# EasyEDA Pro project 高频电路.eprj

# Schematic Schematic1
Create Date: 2024-05-19; Page Name: P1; Project Name: 高频电路; Schematic Name: Schematic1; Update Date: 2024-05-19; Company: 嘉立创EDA; Page Size: A4; Version: V1.0
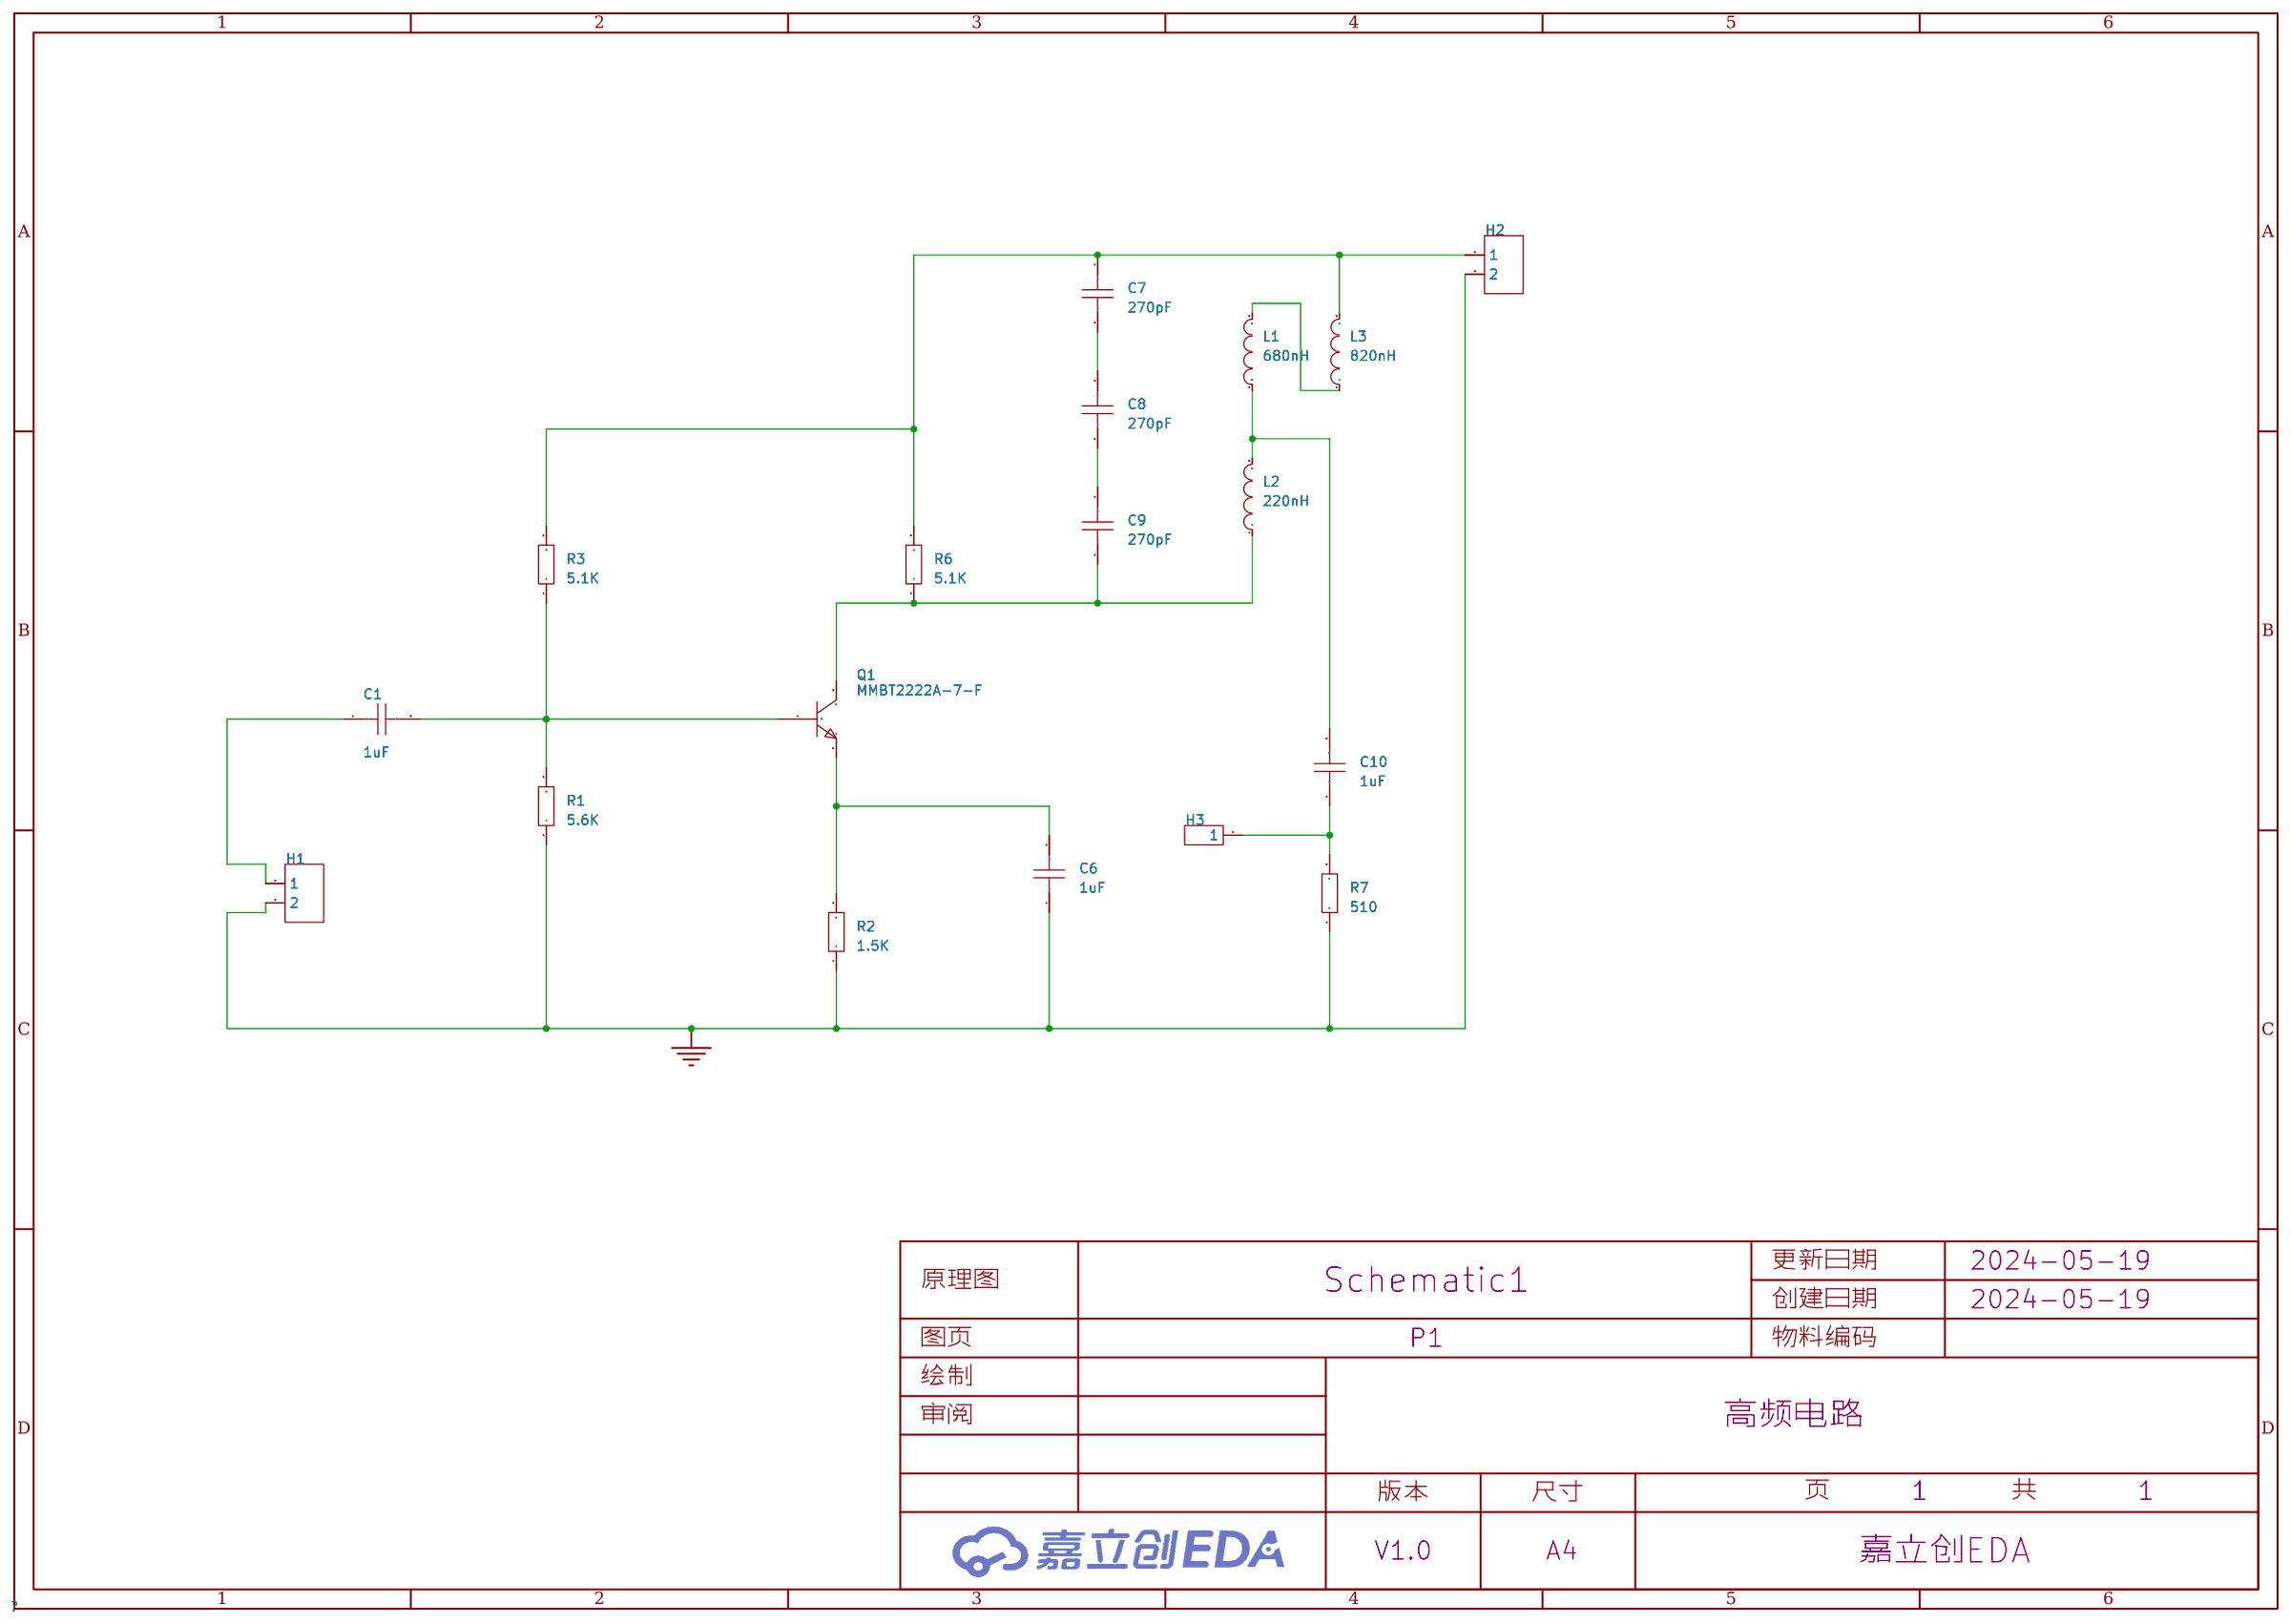
[diagram p0: schematic sheet]

## Parts
C1  1uF  [C0805]
C6  1uF  [C0805]
C7  270pF  [C0805]
C8  270pF  [C0805]
C9  270pF  [C0805]
C10  1uF  [C0805]
H1  -  [HDR-TH_2P-P2.54-V-F]
H2  -  [HDR-TH_2P-P2.54-V-F]
H3  -  [HDR-TH_1P-V-M_XKB_X4611WV-01I-C28D40]
L1  680nH  [L0805]
L2  220nH  [L0805]
L3  820nH  [L0805]
Q1  MMBT2222A-7-F  [SOT-23-3_L2.9-W1.6-P1.90-LS2.8-BR]
R1  5.6K  [R0805]
R2  1.5K  [R0805]
R3  5.1K  [R0805]
R6  5.1K  [R0805]
R7  510  [R0805]

## Library data of the parts
C1 C6-C10 = CAP_0805: Supplier Footprint: 0805
H1 H2 = HDR-F_2.54_1x2P: Supplier Part: C49661; Supplier Footprint: 插件
H3 = HDR-M_2.54_1x1P: Supplier Part: C81276; Supplier Footprint: 插件; JLCPCB Part Class: Extended Part
L1-L3 = L_0805
Q1 = MMBT2222A-7-F: 晶体管类型:NPN;集电极电流(Ic):600mA;集射极击穿电压(Vceo):40V;功率(Pd):310mW;直流电流增益(hFE@Ic,Vce):100@150mA,10V;; LCSC Part Name: 耐压:40V 电流:600mA NPN; Supplier Part: C94515; Manufacturer: DIODES(美台); Supplier Footprint: SOT-23; JLCPCB Part Class: 扩展库; Datasheet: https://atta.szlcsc.com/upload/public/pdf/source/20180307/C94515_15204091498191407767.pdf; Supplier: LCSC; Transistor Type: NPN; Collector Current (Ic): 600mA; Collector-Emitter Breakdown Voltage (Vceo): 40V; Power Dissipation (Pd): 310mW; DC Current Gain (hFE@Ic,Vce): 100@150mA,10V; Transition Frequency (fT): 300MHz; Collector Cut-Off Current (Icbo): 10nA; Collector-Emitter Saturation Voltage (VCE(sat)@Ic,Ib): 1V@500mA,50mA; Operating Temperature: -55℃~+150℃@(Tj)
R1-R3 R6 R7 = Res_0805: Supplier Footprint: 0805

## Nets
GND: C6.1 H1.2 H2.2 R1.1 R2.1 R7.1
Net-(C1-1): C1.1 H1.1
Net-(C1-2): C1.2 Q1.1(B) R1.2 R3.1
Net-(C6-2): C6.2 Q1.2(E) R2.2
Net-(C7-1): C7.1 H2.1 L3.2 R3.2 R6.2
Net-(C7-2): C7.2 C8.2
Net-(C8-1): C8.1 C9.2
Net-(C9-1): C9.1 L2.1 Q1.3(C) R6.1
Net-(C10-1): C10.1 H3.1 R7.2
Net-(C10-2): C10.2 L1.1 L2.2
Net-(L1-2): L1.2 L3.1

# Board PCB1
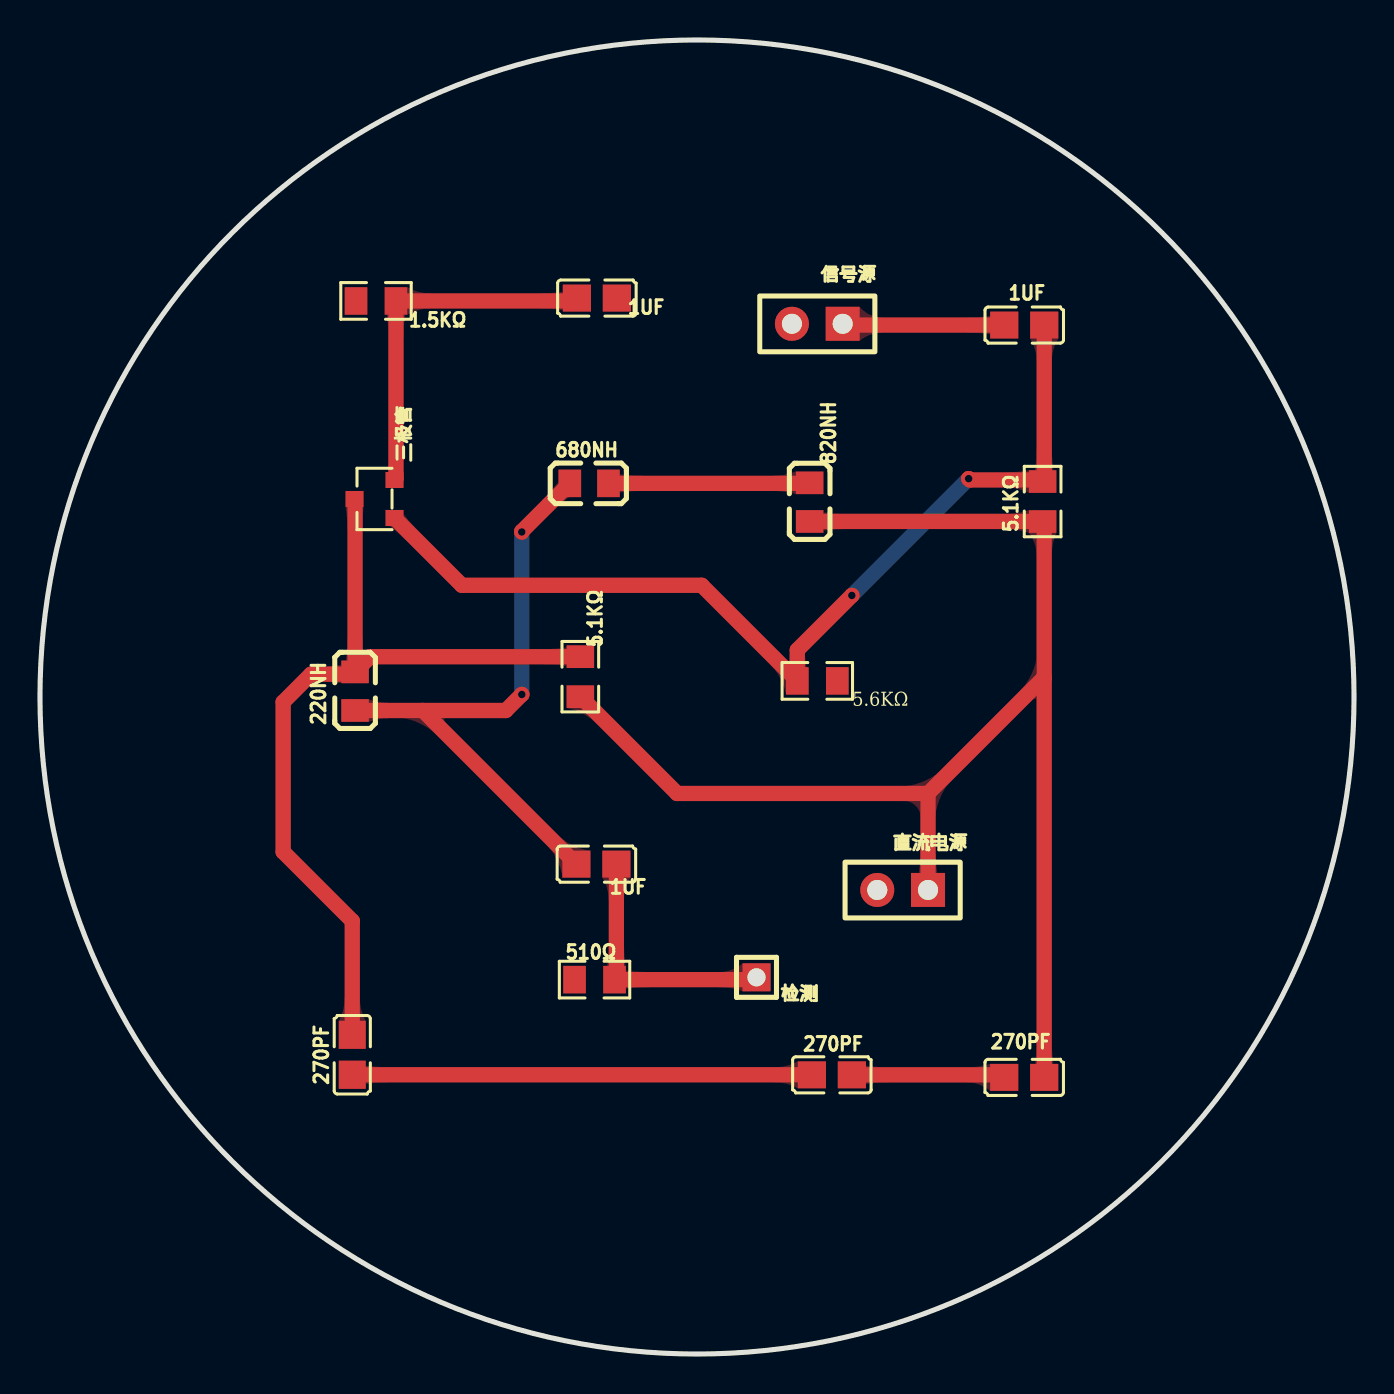
[diagram p1: board, top side]
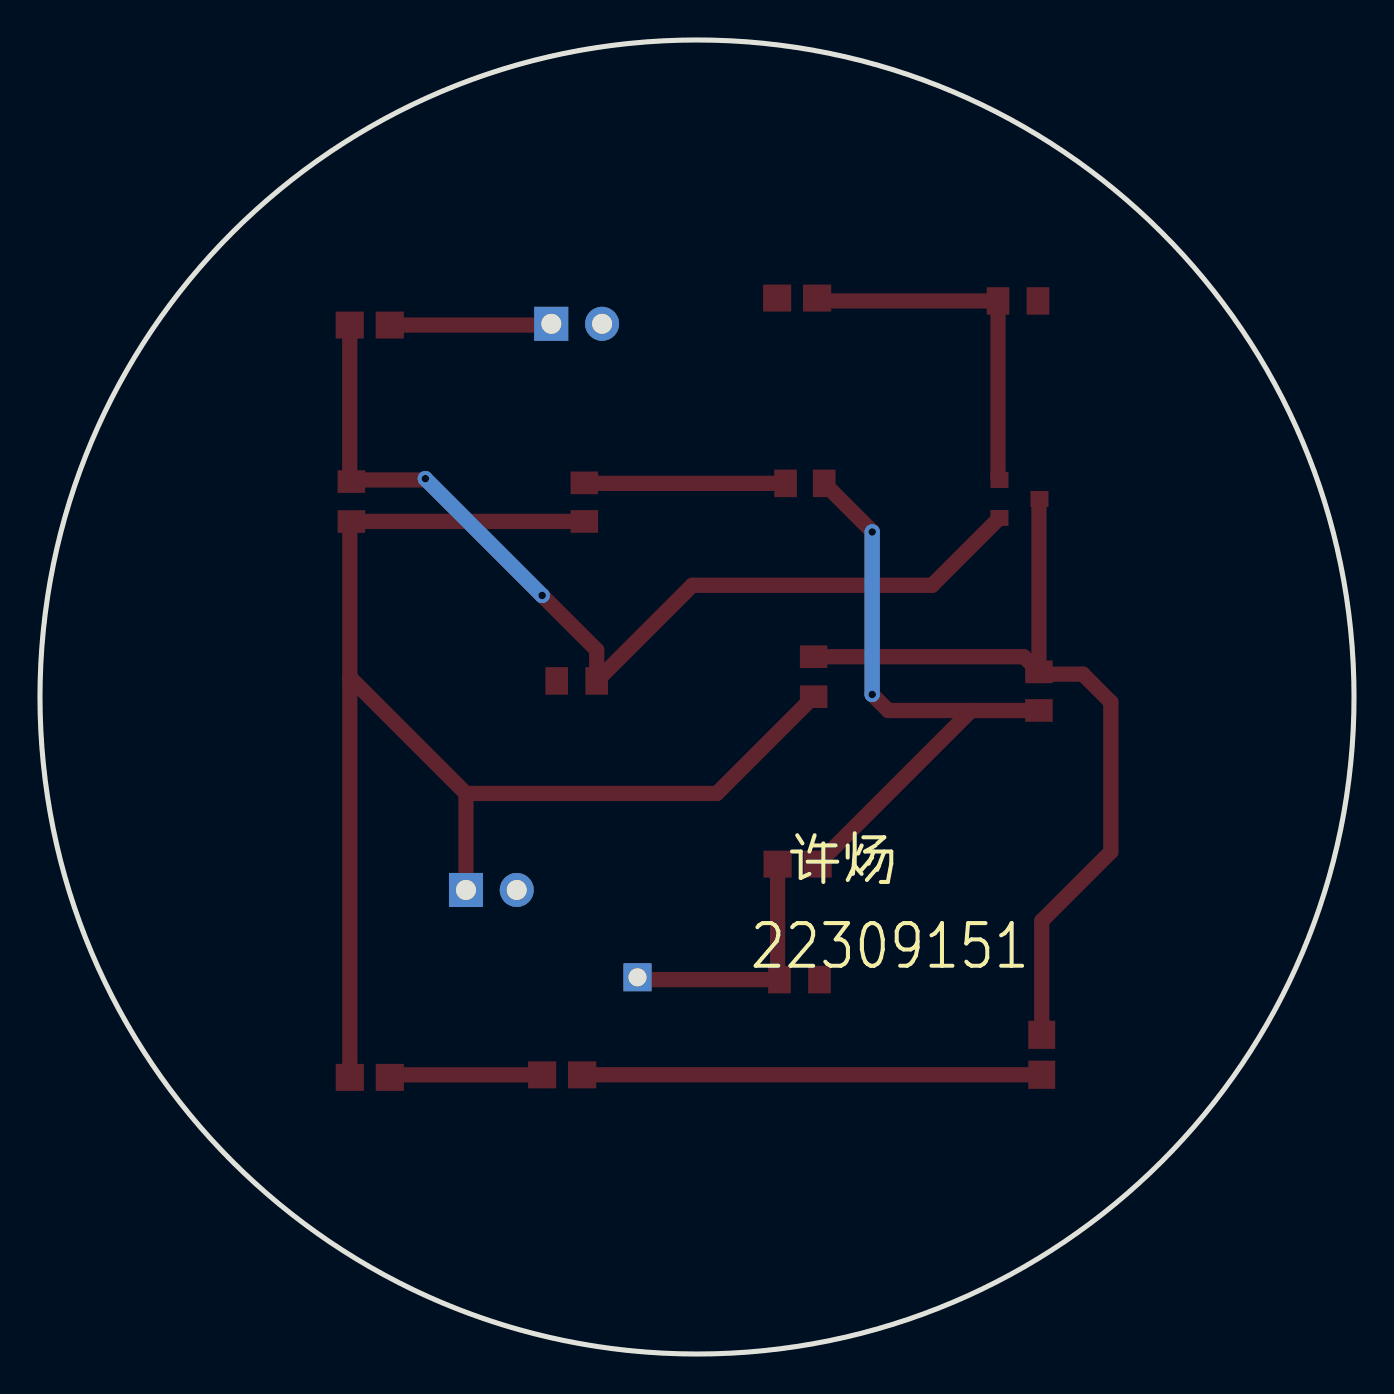
[diagram p2: board, bottom side, seen from below]

Outline 65.73 x 65.73 mm; copper layers: Top Layer, Bottom Layer. Coordinates in mm from the lower left corner of the outline.
Outline path: circle c32.87,32.87 r32.87
Stack: Top Layer 0.035mm / Dielectric1 1.51mm FR4 er 4.5 / Bottom Layer 0.035mm

## Design rules (mm)
template: 自定义配置
spacing copperThickness1oz (default): track to track 0.102, other pairs 0.152 to 0.3
spacing copperThickness2oz: track to track 0.203, other pairs 0.152 to 0.3
track width copperThickness1oz (default): min 0.762, default 0.762, max 2.54
track width copperThickness2oz: min 0.203, default 0.254, max 2.54
differential pair differentialPair (default): width min 0.127, default 0.254, max 2.54; gap min 0.152, default 0.152
via viaSize (default): diameter min 0.5, default 0.61, max 10; hole min 0.3, default 0.305, max 6.299

## Placement (name value [footprint] x y rotation side)
1.5KΩ  1.5K  [R0805]  16.81 52.68 0 top
1UF  -  [C0805]  27.86 52.82 180 top
1UF#2  -  [C0805]  27.83 24.51 180 top
1UF#3  -  [C0805]  49.24 51.47 0 top
5.1KΩ  -  [R0805]  50.15 42.64 270 top
5.1KΩ#2  -  [R0805]  27.03 33.88 270 top
5.6KΩ  5.6K  [R0805]  38.88 33.67 180 top
220NH  220nH  [L0805]  15.76 33.16 270 top
270PF  -  [C0805]  39.61 13.96 0 top
270PF#2  -  [C0805]  49.23 13.84 180 top
270PF#3  -  [C0805]  15.62 14.97 270 top
510Ω  510  [R0805]  27.74 18.73 0 top
680NH  680nH  [L0805]  27.47 43.55 0 top
820NH  820nH  [L0805]  38.5 42.61 270 top
三极管  MMBT2222A-7-F  [SOT-23-3_L2.9-W1.6-P1.90-LS2.8-BR]  16.73 42.77 0 top
信号源  -  [HDR-TH_2P-P2.54-V-F]  38.88 51.53 180 top
检测  -  [HDR-TH_1P-V-M_XKB_X4611WV-01I-C28D40]  35.84 18.84 180 top
直流电源  -  [HDR-TH_2P-P2.54-V-F]  43.15 23.21 180 top

## Footprints (pads in the part's own frame, mm; a bottom-side part is the same pattern mirrored in y, then rotated)
C0805
  rect 1.41x1.35 smd: 1(-1,0) 2(1,0)
HDR-TH_1P-V-M_XKB_X4611WV-01I-C28D40
  rect 1.4x1.4 hole 0.9: 1(0,0)
HDR-TH_2P-P2.54-V-F
  rect 1.7x1.7 hole 1: 1(-1.27,0)
  round 1.7 hole 1: 2(1.27,0)
L0805
  rect 1.133x1.377 smd: 1(-0.966,0) 2(0.966,0)
R0805
  rect 1.133x1.377 smd: 1(-1,0) 2(1,0)
SOT-23-3_L2.9-W1.6-P1.90-LS2.8-BR
  rect 0.9x0.8 smd: 1(1,-0.95) 2(1,0.95) 3(-1,0)

## Nets
GND: 1.5KΩ.1 1UF.1 5.6KΩ.1 510Ω.1 信号源.2 直流电源.2
$1N504: 1.5KΩ.2 1UF.2 三极管.2
$1N520: 1UF#3.2 5.1KΩ.1 5.6KΩ.2 三极管.1
$1N667: 270PF.1 270PF#3.2
$1N670: 270PF.2 270PF#2.2
$1N971: 1UF#3.1 信号源.1
$1N1027: 5.1KΩ#2.1 220NH.1 270PF#3.1 三极管.3
$1N1591: 1UF#2.2 220NH.2 680NH.1
$1N1660: 680NH.2 820NH.1
$1N1748: 5.1KΩ.2 5.1KΩ#2.2 270PF#2.1 820NH.2 直流电源.1
$1N1802: 1UF#2.1 510Ω.2 检测.1

## Via types
v1: diameter 0.762, hole 0.381, Top Layer to Bottom Layer, 4 vias

## Routing (per net, layer and track width the routed paths; a pad name or vN(x,y) marks a point on that pad's centre or on a via; arc(x,y) is an arc through that point)
$1N504: length 18.1
  Top Layer w0.762: 三极管.2 17.81,43.8 1.5KΩ.2 26.71,52.68 1UF.2
$1N520: length 48.9
  Top Layer w0.762: 三极管.1 21.1,38.45 33.1,38.45 5.6KΩ.2 37.88,35.22 v1(40.61,37.95) ; v1(46.45,43.79) 46.52,43.72 50.24,43.72 ; 50.24,43.72 1UF#3.2 ; 50.24,43.72 5.1KΩ.1
  Bottom Layer w0.762: v1(46.45,43.79) v1(40.61,37.95)
$1N667: length 23
  Top Layer w0.762: 270PF.1 38.61,13.97 270PF#3.2
$1N670: length 7.7
  Top Layer w0.762: 270PF#2.2 48.11,13.96 270PF.2
$1N971: length 8.1
  Top Layer w0.762: 信号源.1 40.22,51.47 1UF#3.1
$1N1027: length 42.5
  Top Layer w0.762: 15.76,34.12 15.65,34.01 13.56,34.01 12.16,32.61 12.16,25.12 15.62,21.66 270PF#3.1 ; 15.76,34.12 16.52,34.88 5.1KΩ#2.1 ; 15.76,34.12 15.76,42.74 三极管.3
$1N1591: length 31.1
  Top Layer w0.762: 19.15,32.19 23.3,32.19 v1(24.1,32.99) ; 19.15,32.19 1UF#2.2 ; 19.15,32.19 220NH.2 ; 680NH.1 24.1,41.15 v1(24.1,41.12)
  Bottom Layer w0.762: v1(24.1,41.12) v1(24.1,32.99)
$1N1660: length 10.1
  Top Layer w0.762: 38.5,43.58 38.47,43.55 680NH.2
$1N1748: length 71.9
  Top Layer w0.762: 820NH.2 50.15,41.65 5.1KΩ.2 50.23,41.56 50.23,33.85 50.2,33.82 ; 270PF#2.1 50.23,33.79 50.2,33.82 ; 44.42,28.04 31.87,28.04 5.1KΩ#2.2 ; 44.42,28.04 50.2,33.82 ; 44.42,28.04 直流电源.1
$1N1802: length 13
  Top Layer w0.762: 1UF#2.1 28.83,18.82 510Ω.2 35.73,18.73 检测.1

## Copper pours and planes (outline as drawn; the poured copper is in the pictures)
GND on Top Layer: -39.52,72.62 108.56,72.62 108.56,-6.89 -39.52,-6.89
GND on Bottom Layer: -17.81,77.06 83.28,77.06 83.28,-11.46 -17.81,-11.46

Small or netless copper shapes (teardrops, artwork), in the pictures only: 38 on Top Layer

## Text on the board
Bottom Silkscreen Layer: 22309151 | 许炀
